# Altium project FMC_SDR.PrjPCB (part 1 of 2)
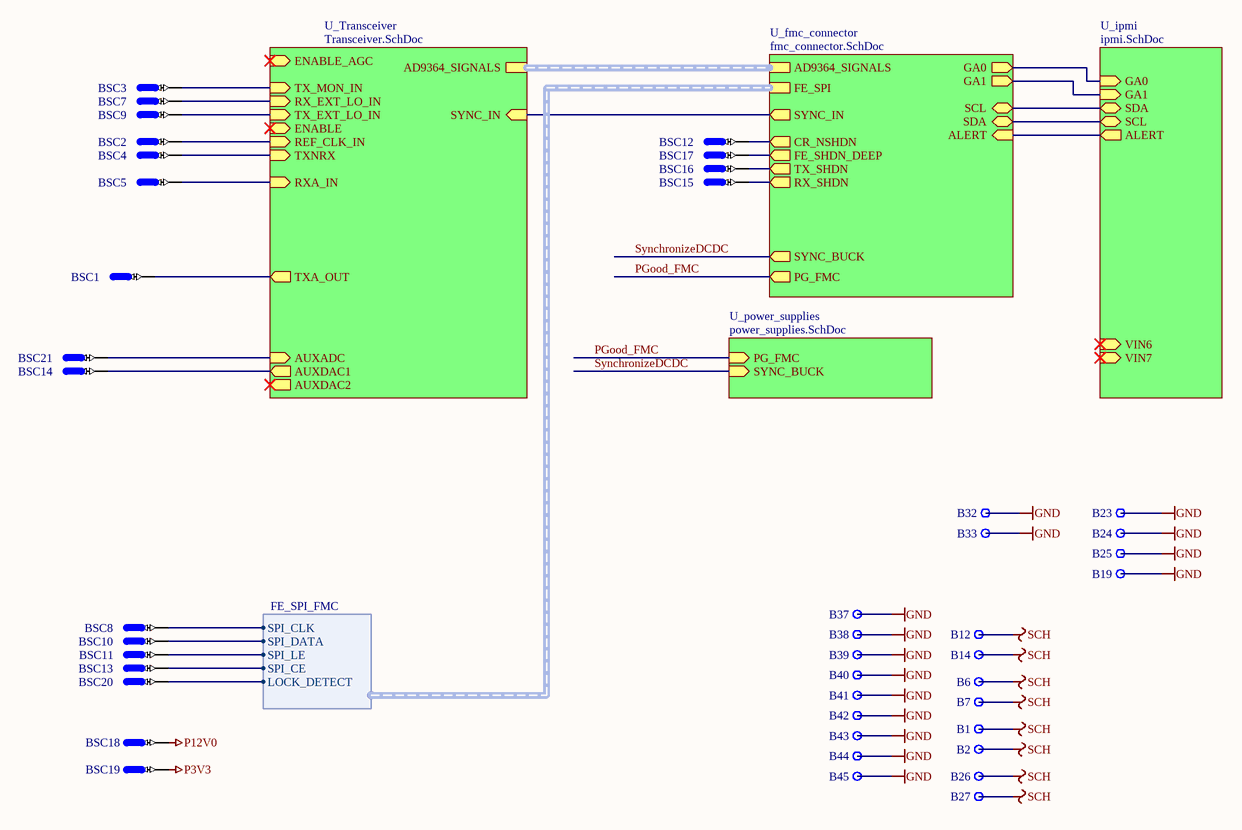
[diagram p0: FMC_SDR_top.SchDoc]
5 sheets, 191 parts. Net scope: flat (ports and power ports of the same name join across sheets).
Board file: FMC_SDR.PcbDoc
Sheets:
  FMC_SDR_top.SchDoc
    U_ipmi = ipmi.SchDoc
    U_power_supplies = power_supplies.SchDoc
    U_Transceiver = Transceiver.SchDoc
    U_fmc_connector = fmc_connector.SchDoc

## Sheet FMC_SDR_top.SchDoc: FMC front panel
size 297 x 209 mm; Date: .DATE; CheckedBy: vanderby; CompanyName: CERN; DrawnBy: mcattin; Engineer: mcattin; Organization: CERN; Address1: European Organization for Nuclear Research; Address2: CH-1211 Genève 23 - Switzerland; DocumentNumber: 3; Revision: -; SheetNumber: 3; SheetTotal: 5; EDA_Number: EDA-02064-V1-0; Projet: FmcDIO16chTTLa; ModifiedBy: mcattin; CreateDate: 11/04/2009; CheckedDate: 11/26/2009; Title2: External connections; DivGrp: BE-CO-HT; Designer: mcattin; ModifiedDate: -

### Parts
B1  Plated Hole  [MTG240_400]  (value not drawn)  (no BOM)
B2  Plated Hole  [MTG240_400]  (value not drawn)  (no BOM)
B6  Plated Hole  [MTG240_400]  (value not drawn)  (no BOM)
B7  Plated Hole  [MTG240_400]  (value not drawn)  (no BOM)
B12  Plated Hole  [MTG240_400]  (value not drawn)  (no BOM)
B14  Plated Hole  [MTG240_400]  (value not drawn)  (no BOM)
B19  Plated Hole  [MTG270_500]  (value not drawn)
B23  Plated Hole  [MTG270_500]  (value not drawn)
B24  Plated Hole  [MTG270_500]  (value not drawn)
B25  Plated Hole  [MTG270_500]  (value not drawn)
B26  Plated Hole  [MTG240_400]  (value not drawn)  (no BOM)
B27  Plated Hole  [MTG240_400]  (value not drawn)  (no BOM)
B32  Plated Hole  [MTG240_400]  (value not drawn)  (no BOM)
B33  Plated Hole  [MTG240_400]  (value not drawn)  (no BOM)
B37  Plated Hole  [MTG240_400]  (value not drawn)  (no BOM)
B38  Plated Hole  [MTG240_400]  (value not drawn)  (no BOM)
B39  Plated Hole  [MTG240_400]  (value not drawn)  (no BOM)
B40  Plated Hole  [MTG240_400]  (value not drawn)  (no BOM)
B41  Plated Hole  [MTG240_400]  (value not drawn)  (no BOM)
B42  Plated Hole  [MTG240_400]  (value not drawn)  (no BOM)
B43  Plated Hole  [MTG240_400]  (value not drawn)  (no BOM)
B44  Plated Hole  [MTG240_400]  (value not drawn)  (no BOM)
B45  Plated Hole  [MTG240_400]  (value not drawn)  (no BOM)
BSC1  0603 Female  [PCB_CONN_0603F]  (value not drawn)
BSC2  0603 Female  [PCB_CONN_0603F]  (value not drawn)
BSC3  0603 Female  [PCB_CONN_0603F]  (value not drawn)
BSC4  0603 Female  [PCB_CONN_0603F]  (value not drawn)
BSC5  0603 Female  [PCB_CONN_0603F]  (value not drawn)
BSC7  0603 Female  [PCB_CONN_0603F]  (value not drawn)
BSC8  0603 Female  [PCB_CONN_0603F]  (value not drawn)
BSC9  0603 Female  [PCB_CONN_0603F]  (value not drawn)
BSC10  0603 Female  [PCB_CONN_0603F]  (value not drawn)
BSC11  0603 Female  [PCB_CONN_0603F]  (value not drawn)
BSC12  0603 Female  [PCB_CONN_0603F]  (value not drawn)
BSC13  0603 Female  [PCB_CONN_0603F]  (value not drawn)
BSC14  0603 Female  [PCB_CONN_0603F]  (value not drawn)
BSC15  0603 Female  [PCB_CONN_0603F]  (value not drawn)
BSC16  0603 Female  [PCB_CONN_0603F]  (value not drawn)
BSC17  0603 Female  [PCB_CONN_0603F]  (value not drawn)
BSC18  1206 Female  [PCB_CONN_1206F]  (value not drawn)
BSC19  1206 Female  [PCB_CONN_1206F]  (value not drawn)
BSC20  0603 Female  [PCB_CONN_0603F]  (value not drawn)
BSC21  0603 Female  [PCB_CONN_0603F]  (value not drawn)

### Sub-sheets
U_fmc_connector = fmc_connector.SchDoc: AD9364_SIGNALS (harness ADF5356_SPI), SCL (bidir), SDA (bidir), GA0 (out), GA1 (out), PG_FMC (out), ALERT (in), SYNC_IN (out), SYNC_BUCK (out), RX_SHDN (out), TX_SHDN (out), FE_SPI (harness FE_SPI_FMC), FE_SHDN_DEEP (out), CR_NSHDN (out)
U_ipmi = ipmi.SchDoc: GA0 (in), GA1 (in), SDA (bidir), VIN6 (in), SCL (bidir), ALERT (out), VIN7 (in)
U_power_supplies = power_supplies.SchDoc: PG_FMC (in), SYNC_BUCK (in)
U_Transceiver = Transceiver.SchDoc: TX_MON_IN (in), RX_EXT_LO_IN (in), SYNC_IN (in), ENABLE_AGC (in), AD9364_SIGNALS (harness AD9364_SIG), TX_EXT_LO_IN (in), ENABLE (in), TXNRX (in), REF_CLK_IN (in), RXA_IN (in), TXA_OUT (out), AUXDAC2 (out), AUXADC (in), AUXDAC1 (out)

### Harnesses
FE_SPI_FMC: SPI_CLK, SPI_DATA, SPI_LE, SPI_CE, LOCK_DETECT

### Nets
GND: B19.1 B23.1 B24.1 B25.1 B32.1 B33.1 B37.1 B38.1 B39.1 B40.1 B41.1 B42.1 B43.1 B44.1 B45.1
P3V3: BSC19.1
P12V0: BSC18.1
SCH: B1.1 B2.1 B6.1 B7.1 B12.1 B14.1 B26.1 B27.1
PGood_FMC: sheet U_power_supplies/PG_FMC, sheet U_fmc_connector/PG_FMC
SynchronizeDCDC: sheet U_power_supplies/SYNC_BUCK, sheet U_fmc_connector/SYNC_BUCK
NetBSC1_1: BSC1.1 ; sheet U_Transceiver/TXA_OUT
NetBSC2_1: BSC2.1 ; sheet U_Transceiver/REF_CLK_IN
NetBSC3_1: BSC3.1 ; sheet U_Transceiver/TX_MON_IN
NetBSC4_1: BSC4.1 ; sheet U_Transceiver/TXNRX
NetBSC5_1: BSC5.1 ; sheet U_Transceiver/RXA_IN
NetBSC7_1: BSC7.1 ; sheet U_Transceiver/RX_EXT_LO_IN
NetBSC8_1: BSC8.1 ; sheet U_fmc_connector/FE_SPI.SPI_CLK
NetBSC9_1: BSC9.1 ; sheet U_Transceiver/TX_EXT_LO_IN
NetBSC10_1: BSC10.1 ; sheet U_fmc_connector/FE_SPI.SPI_DATA
NetBSC11_1: BSC11.1 ; sheet U_fmc_connector/FE_SPI.SPI_LE
NetBSC12_1: BSC12.1 ; sheet U_fmc_connector/CR_NSHDN
NetBSC13_1: BSC13.1 ; sheet U_fmc_connector/FE_SPI.SPI_CE
NetBSC14_1: BSC14.1 ; sheet U_Transceiver/AUXDAC1
NetBSC15_1: BSC15.1 ; sheet U_fmc_connector/RX_SHDN
NetBSC16_1: BSC16.1 ; sheet U_fmc_connector/TX_SHDN
NetBSC17_1: BSC17.1 ; sheet U_fmc_connector/FE_SHDN_DEEP
NetBSC20_1: BSC20.1 ; sheet U_fmc_connector/FE_SPI.LOCK_DETECT
NetBSC21_1: BSC21.1 ; sheet U_Transceiver/AUXADC
(unnamed): sheet U_ipmi/GA0, sheet U_fmc_connector/GA0
(unnamed): sheet U_ipmi/GA1, sheet U_fmc_connector/GA1
(unnamed): sheet U_ipmi/SDA, sheet U_fmc_connector/SCL
(unnamed): sheet U_ipmi/SCL, sheet U_fmc_connector/SDA
(unnamed): sheet U_ipmi/ALERT, sheet U_fmc_connector/ALERT
(unnamed): sheet U_Transceiver/SYNC_IN, sheet U_fmc_connector/SYNC_IN

### Buses and harness runs
harness sheet U_fmc_connector/AD9364_SIGNALS = sheet U_Transceiver/AD9364_SIGNALS

### Notes on the sheet
- Project/Equipment
- Document
- Designer
- Drawn by
- Check.by
- File
- Last Mod.
- Print Date
- Sheet
- Size
- A4
- of
- Rev

### Library data of the parts
B1 B2 B6 B7 B12 B14 B26 B27 B32 B33 B37-B45 = PLATED_HOLE2.4_PAD4.0: Single Terminal Socket; Part Description: Plated Through Hole: Hole Dia.=2.4mm Pad Dia.=4.0mm; Mounted: No; Table: Pads; Part Number: PLATED_HOLE2.4_PAD4.0; Component Type: Standard (No BOM); Pin Count: 1; Family: Plated Hole; Socket: No; SMD: No; Status: None; ComponentHeight: 0mm; Author: CERN DEM JMW; CreateDate: 2011-10-10; LatestRevisionDate: 2011-10-10; PackageDescription: Plated Through Hole: Hole Dia.=2.4mm Pad Dia.=4.0mm
B19 B23-B25 = PLATED_HOLE2.7_PAD5.0: Single Terminal Socket; Part Description: Plated Through Hole: Hole Dia.=2.7mm Pad Dia.=5.0mm; Mounted: No; Part Number: PLATED_HOLE2.7_PAD5.0; Component Kind: Standard (No BOM); Component Type: Standard (No BOM); Pin Count: 1; Family: Plated Hole; Socket: No; SMD: No; Sense: No; Status: None; ComponentHeight: 0mm; HelpURL: Undefined; Author: CERN DEM JMW; CreateDate: 27/09/2011; LatestRevisionDate: 27/09/2011; PackageDescription: Plated Through Hole: Hole Dia.=2.7mm Pad Dia.=5.0mm
BSC1-BSC5 BSC7-BSC17 BSC20 BSC21 = 0603_female_BoardSolderConnector: Part Description: Board connection - soldered 0603 jumper; PressFit: No; Pin Count: 1; Socket: No; SMD: Yes; Sense: No; Status: None; System: Connector
BSC18 BSC19 = 1206_female_BoardSolderConnector: Part Description: Board connection - soldered 1206 jumper; PressFit: No; Pin Count: 1; Socket: No; SMD: Yes; Sense: No; Status: None; System: Connector

## Sheet ipmi.SchDoc: FMC IPMI
size 297 x 209 mm; CheckedBy: vanderby; CompanyName: CERN; DrawnBy: mcattin; Engineer: mcattin; Organization: CERN; Address1: European Organization for Nuclear Research; Address2: CH-1211 Genève 23 - Switzerland; DocumentNumber: 2; Revision: -; SheetNumber: 2; SheetTotal: 5; EDA_Number: EDA-02064-V1-0; Projet: FmcDIO16chTTLa; ModifiedBy: mcattin; CreateDate: 11/04/2009; CheckedDate: 11/26/2009; Title2: EEPROM, temperature sensor; DivGrp: BE-CO-HT; Designer: mcattin; CurrentDate: .DATE; ModifiedDate: -
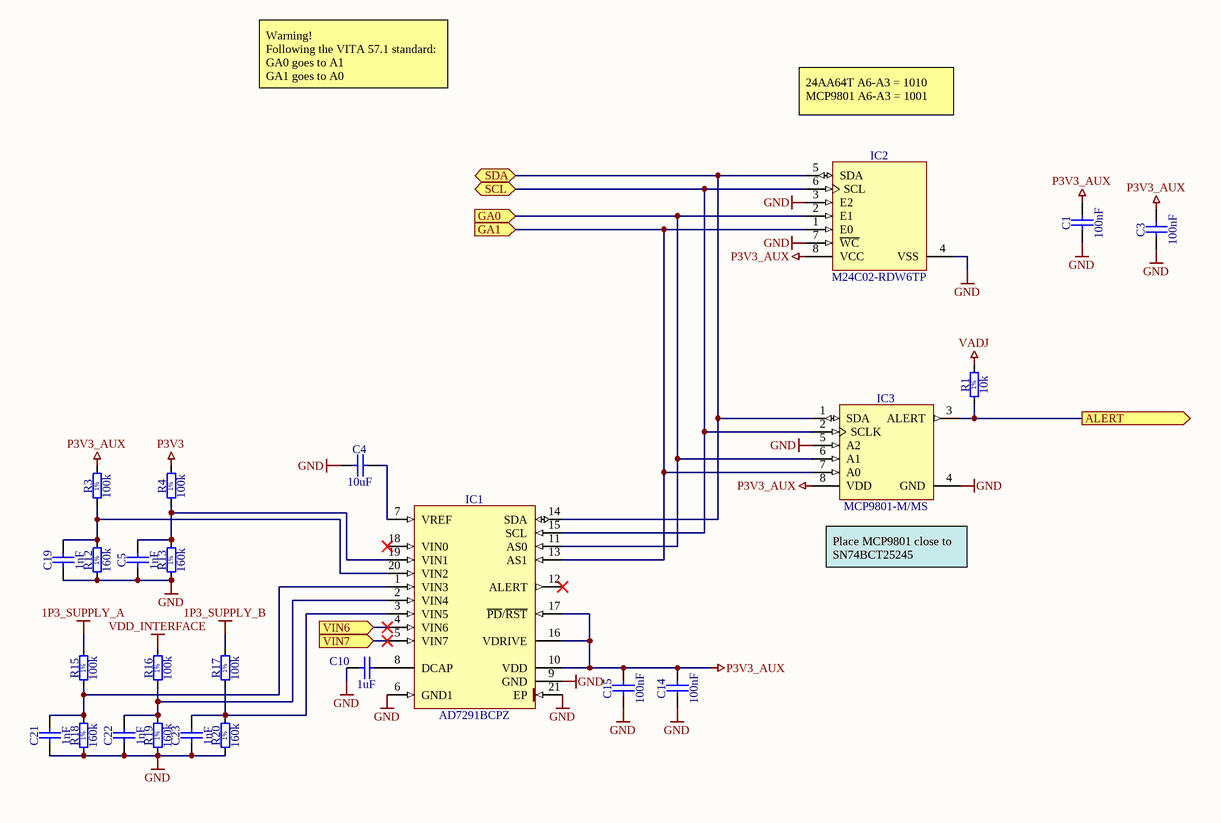
[diagram p1: ipmi.SchDoc]

### Parts
C1  100nF  [CAPC1005X55N]
C3  100nF  [CAPC1005X55N]
C4  10uF  [CAPC1608X87N]
C5  1nF  [CAPC1005X55N]
C10  1uF  [CAPC1608X87N]
C14  100nF  [CAPC1005X55N]
C15  100nF  [CAPC1005X55N]
C19  1nF  [CAPC1005X55N]
C21  1nF  [CAPC1005X55N]
C22  1nF  [CAPC1005X55N]
C23  1nF  [CAPC1005X55N]
IC1  AD7291BCPZ  [QFN50P400X400X80-21N-S275]
IC2  M24C02-RDW6TP  [SOP65P640X120-8N]
IC3  MCP9801-M/MS  [SOP65P490X110-8N]
R1  10k  [RESC1005X40N]
R3  100k  [RESC1005X40N]
R4  100k  [RESC1005X40N]
R12  160k  [RESC1005X40N]
R13  160k  [RESC1005X40N]
R15  100k  [RESC1005X40N]
R16  100k  [RESC1005X40N]
R17  100k  [RESC1005X40N]
R18  160k  [RESC1005X40N]
R19  160k  [RESC1005X40N]
R20  160k  [RESC1005X40N]

### Ports
ALERT (out), GA0 (in), GA1 (in), SCL (bidir), SDA (bidir), VIN6 (in), VIN7 (in)

### Nets
1P3_SUPPLY_A: R15.2
1P3_SUPPLY_B: R17.2
GND: C1.1 C3.1 C4.1 C5.1 C10.1 C14.1 C15.1 C19.1 C21.1 C22.1 C23.1 IC1.6(GND1) IC1.9(GND) IC1.21(EP) IC2.3(E2) IC2.4(VSS) IC2.7(~{WC}) IC3.4(GND) IC3.5(A2) R12.1 R13.1 R18.1 R19.1 R20.1
P3V3: R4.2
P3V3_AUX: C1.2 C3.2 C14.2 C15.2 IC1.10(VDD) IC1.16(VDRIVE) IC1.17(~{PD}/~{RST}) IC2.8(VCC) IC3.8(VDD) R3.2
VADJ: R1.2
VDD_INTERFACE: R16.2
NetC4_2: C4.2 IC1.7(VREF)
NetC5_2: C5.2 IC1.19(VIN1) R4.1 R13.2
NetC10_2: C10.2 IC1.8(DCAP)
NetC19_2: C19.2 IC1.20(VIN2) R3.1 R12.2
NetC21_2: C21.2 IC1.1(VIN3) R15.1 R18.2
NetC22_2: C22.2 IC1.2(VIN4) R16.1 R19.2
NetC23_2: C23.2 IC1.3(VIN5) R17.1 R20.2
NetIC1_4: IC1.4(VIN6) ; port VIN6
NetIC1_5: IC1.5(VIN7) ; port VIN7
NetIC1_11: IC1.11(AS0) IC2.2(E1) IC3.6(A1) ; port GA0
NetIC1_13: IC1.13(AS1) IC2.1(E0) IC3.7(A0) ; port GA1
NetIC1_14: IC1.14(SDA) IC2.5(SDA) IC3.1(SDA) ; port SDA
NetIC1_15: IC1.15(SCL) IC2.6(SCL) IC3.2(SCLK) ; port SCL
NetIC3_3: IC3.3(ALERT) R1.1 ; port ALERT

Not connected (* = marked no-connect by the designer): IC1 12(ALERT)* 18(VIN0)*

### Notes on the sheet
- Warning!
  Following the VITA 57.1 standard:
  GA0 goes to A1
  GA1 goes to A0
- 24AA64T A6-A3 = 1010
  MCP9801 A6-A3 = 1001
- (near IC3) Place MCP9801 close to SN74BCT25245
- Project/Equipment
- Document
- Designer
- Drawn by
- Check.by
- File
- Last Mod.
- Print Date
- Sheet
- Size
- A4
- of
- Rev
- (in symbol R0402_10K_1%_0.0625W_100PPM) 1%
- (in symbol R0402_100K_1%_0.0625W_100PPM) 1%
- (in symbol R0402_160K_1%_0.0625W_100PPM) 1%

### Library data of the parts
C1 C3 C14 C15 = CC0402_100NF_16V_10%_X7R: Non-polarised capacitor; Part Description: SMD Multilayer Chip Ceramic Capacitor; Manufacturer: GENERIC; Manufacturer1 Part Number: GRM155R71C104KA88D; Voltage: 16V; TC: X7R; Tolerance: ±10%; Part Number: CC0402_100NF_16V_10%_X7R; Component Kind: Standard; Component Type: Standard; Pin Count: 2; Value: 100nF; Status: Not Recommended; Manufacturer Part Number: CC0402_100NF_16V_10%_X7R; Case: 0402; Mounted: Yes; Socket: No; SMD: Yes; Sense: No; Manufacturer1 Example: MURATA; Manufacturer1 ComponentHeight: 0.55mm; HelpURL: \\cern.ch\dfs\Applications\Altium\Datasheets\CC0402_X7R_MURATA_GRM.pdf; Author: CERN DEM JLC; CreateDate: 05.12.2013; LatestRevisionDate: 03.12.2007
C4 = CC0603_10UF_6.3V_20%_X5R: Non-polarised capacitor; Part Description: SMD Multilayer Chip Ceramic Capacitor; Manufacturer: GENERIC; Manufacturer1 Part Number: C0603C106M9PAC; Voltage: 6.3V; TC: X5R; Tolerance: ±20%; Part Number: CC0603_10UF_6.3V_20%_X5R; Component Kind: Standard; Component Type: Standard; Pin Count: 2; Value: 10uF; Status: Preferred; Manufacturer Part Number: CC0603_10uF_6.3V_20%_X5R; Case: 0603; Mounted: Yes; Socket: No; SMD: Yes; Sense: No; Manufacturer1 Example: KEMET; Manufacturer1 ComponentHeight: 0.95mm; HelpURL: \\cern.ch\dfs\Applications\Altium\Datasheets\CC0603_X5R_KEMET.pdf; Author: CERN DEM JLC; CreateDate: 03.12.2007; LatestRevisionDate: 03.12.2007
C5 C19 C21-C23 = CC0402_1NF_50V_10%_X7R: Non-polarised capacitor; Part Description: SMD Multilayer Chip Ceramic Capacitor; Manufacturer: GENERIC; Manufacturer1 Part Number: 223858715623; Voltage: 50V; TC: X7R; Tolerance: ±10%; Part Number: CC0402_1NF_50V_10%_X7R; Component Kind: Standard; Component Type: Standard; Pin Count: 2; Value: 1nF; Status: Not Recommended; Manufacturer Part Number: CC0402_1NF_50V_10%_X7R; Case: 0402; Mounted: Yes; Socket: No; SMD: Yes; Sense: No; Manufacturer1 Example: PHYCOMP; Manufacturer1 ComponentHeight: 0.55mm; HelpURL: \\cern.ch\dfs\Applications\Altium\Datasheets\CC0402_X7R_PHYCOMP.pdf; Author: CERN DEM JLC; CreateDate: 03.12.2007; LatestRevisionDate: 03.12.2007
C10 = CC0603_1UF_16V_10%_X7R: Non-polarised capacitor; Part Description: SMD Multilayer Chip Ceramic Capacitor; Manufacturer: GENERIC; Manufacturer1 Part Number: 223878615663; Voltage: 16V; TC: X7R; Tolerance: ±10%; Part Number: CC0603_1UF_16V_10%_X7R; Component Kind: Standard; Component Type: Standard; Pin Count: 2; Value: 1uF; Status: None; Manufacturer Part Number: CC0603_1uF_16V_10%_X7R; Case: 0603; Mounted: Yes; Socket: No; SMD: Yes; Sense: No; Manufacturer1 Example: YAGEO PHYCOMP; Manufacturer1 ComponentHeight: 0.9mm; HelpURL: \\cern.ch\dfs\Applications\Altium\Datasheets\CC0603_X7R_PHYCOMP.pdf; Author: CERN DEM JLC; CreateDate: 03.12.2007; LatestRevisionDate: 17.04.2015
IC1 = AD7291BCPZ: 8-Channel, I2C, 12-Bit SAR ADC with Temperature Sensor; Manufacturer: ANALOG DEVICES; PressFit: No; Bonding: No; Part Number: AD7291BCPZ; Component Kind: Standard; Component Type: Standard; Device: AD7291BCPZ; PackageDescription: QFN, 0.50mm Pitch, Square; 20 Pin, 4.00mm L X 4.00mm W X 0.80mm H Body (w/Thermal Tab 2.75 X 2.75mm),  IPC Medium Density; Part Description: 8-Channel, I2C, 12-Bit SAR ADC with Temperature Sensor; Manufacturer Part Number: AD7291BCPZ; Pin Count: 21; Case: QFN20; Mounted: Yes; Socket: No; SMD: Yes; Sense: No; ComponentHeight: 0.8mm; Author: CERN DEM JLC; HelpURL: \\cern.ch\dfs\Applications\Altium\Datasheets\AD7291BCPZ.pdf; CreateDate: 29.08.2017; LatestRevisionDate: 29.08.2017
IC2 = M24C02-RDW6TP: 2-Kbit (256 x 8bit) Serial I2C Bus EEPROM; Manufacturer: ST MICROELECTRONICS; PressFit: No; Bonding: No; Part Number: M24C02-RDW6TP; Component Kind: Standard; Component Type: Standard; Device: M24C02-RDW6TP; PackageDescription: SOP, 0.65mm pitch; 8 pin, 4.40mm W X 3.00mm L X 1.20mm H body, IPC Medium Density; Part Description: 2-Kbit (256 x 8bit) Serial I2C Bus EEPROM; Manufacturer Part Number: M24C02-RDW6TP; Pin Count: 8; Case: TSSOP8; Mounted: Yes; Socket: No; SMD: Yes; Sense: No; ComponentHeight: 1.2mm; HelpURL: \\cern.ch\dfs\Applications\Altium\Datasheets\M24C02-RDW6TP.pdf; Author: CERN DEM JLC; CreateDate: 30.08.2017; LatestRevisionDate: 30.08.2017
IC3 = MCP9801-M/MS: 2-Wire High-Accuracy Temperature Sensor; Manufacturer: MICROCHIP TECHNOLOGIY; Table: Sensors; Part Number: MCP9801-M/MS; Component Kind: Standard; Component Type: Standard; Designator: MCP9801-M/MS; Device: MCP9801-M/MS; PackageDescription: SOP, 0.65mm pitch; 8 pin, 3.00mm W X 3.00mm L X 1.10mm H body, IPC Medium Density; Part Description: 2-Wire High-Accuracy Temperature Sensor; Manufacturer Part Number: MCP9801-M/MS; Pin Count: 8; Case: MSOP8; Mounted: Yes; Socket: No; SMD: Yes; ComponentHeight: 1.1mm; Datasheet: \\cern.ch\dfs\Applications\Altium\Datasheets\MCP9801-M-MS.pdf; HelpURL: \\cern.ch\dfs\Applications\Altium\Datasheets\MCP9801-M-MS.pdf; Author: CERN DEM JLC; CreateDate: 11/18/2009; LatestRevisionDate: 11/18/2009
R1 = R0402_10K_1%_0.0625W_100PPM: Resistor - 1%; Part Description: General Purpose Thick Film Chip Resistor; Manufacturer: GENERIC; Manufacturer1 Part Number: 232270671003L; TC: ±100ppm/°C; PressFit: No; Part Number: R0402_10K_1%_0.0625W_100PPM; Component Kind: Standard; Component Type: Standard; Pin Count: 2; Value: 10k; Status: Not Recommended; Power: 0.0625W; Tolerance: ±1%; Manufacturer Part Number: R0402_10K_1%_0.0625W_100PPM; Case: 0402; Mounted: Yes; Sense: No; Socket: No; SMD: Yes; Manufacturer1 Example: YAGEO PHYCOMP; Manufacturer1 ComponentHeight: 0.4mm; HelpURL: \\cern.ch\dfs\Applications\Altium\Datasheets\R0402_Phycomp_RC0402.pdf; Author: CERN DEM JLC; CreateDate: 03.12.2007; LatestRevisionDate: 17.10.2012
R3 R4 R15-R17 = R0402_100K_1%_0.0625W_100PPM: Resistor - 1%; Part Description: General Purpose Thick Film Chip Resistor; Manufacturer: GENERIC; Manufacturer1 Part Number: 232270671004L; TC: ±100ppm/°C; PressFit: No; Part Number: R0402_100K_1%_0.0625W_100PPM; Component Kind: Standard; Component Type: Standard; Pin Count: 2; Value: 100k; Status: Not Recommended; Power: 0.0625W; Tolerance: ±1%; Manufacturer Part Number: R0402_100K_1%_0.0625W_100PPM; Case: 0402; Mounted: Yes; Sense: No; Socket: No; SMD: Yes; Manufacturer1 Example: YAGEO PHYCOMP; Manufacturer1 ComponentHeight: 0.4mm; HelpURL: \\cern.ch\dfs\Applications\Altium\Datasheets\R0402_Phycomp_RC0402.pdf; Author: CERN DEM JLC; CreateDate: 03.12.2007; LatestRevisionDate: 17.10.2012
R12 R13 R18-R20 = R0402_160K_1%_0.0625W_100PPM: Resistor - 1%; Part Description: General Purpose Thick Film Chip Resistor; Manufacturer: GENERIC; Manufacturer1 Part Number: 232270671604L; TC: ±100ppm/°C; PressFit: No; Part Number: R0402_160K_1%_0.0625W_100PPM; Component Kind: Standard; Component Type: Standard; Pin Count: 2; Value: 160k; Status: Not Recommended; Power: 0.0625W; Tolerance: ±1%; Manufacturer Part Number: R0402_160K_1%_0.0625W_100PPM; Case: 0402; Mounted: Yes; Sense: No; Socket: No; SMD: Yes; Manufacturer1 Example: YAGEO PHYCOMP; Manufacturer1 ComponentHeight: 0.4mm; HelpURL: \\cern.ch\dfs\Applications\Altium\Datasheets\R0402_Phycomp_RC0402.pdf; Author: CERN DEM JLC; CreateDate: 03.12.2007; LatestRevisionDate: 17.10.2012

## Sheet power_supplies.SchDoc: Title
size 420 x 297 mm; CheckedBy: -; CompanyName: CERN; DrawnBy: DrawnBy; Organization: CERN; Address1: European Organization for Nuclear Research; Address2: CH-1211 Genčve 23 - Switzerland; Revision: -; SheetNumber: -; SheetTotal: -; EDA_Number: EDA-XXXXX-VX-X; Projet: -; ModifiedBy: -; CreateDate: XX/XX/XXXX; CheckedDate: -; Title2: Title2; DivGrp: TE/MPE; Designer: Designer; ModifiedDate: -
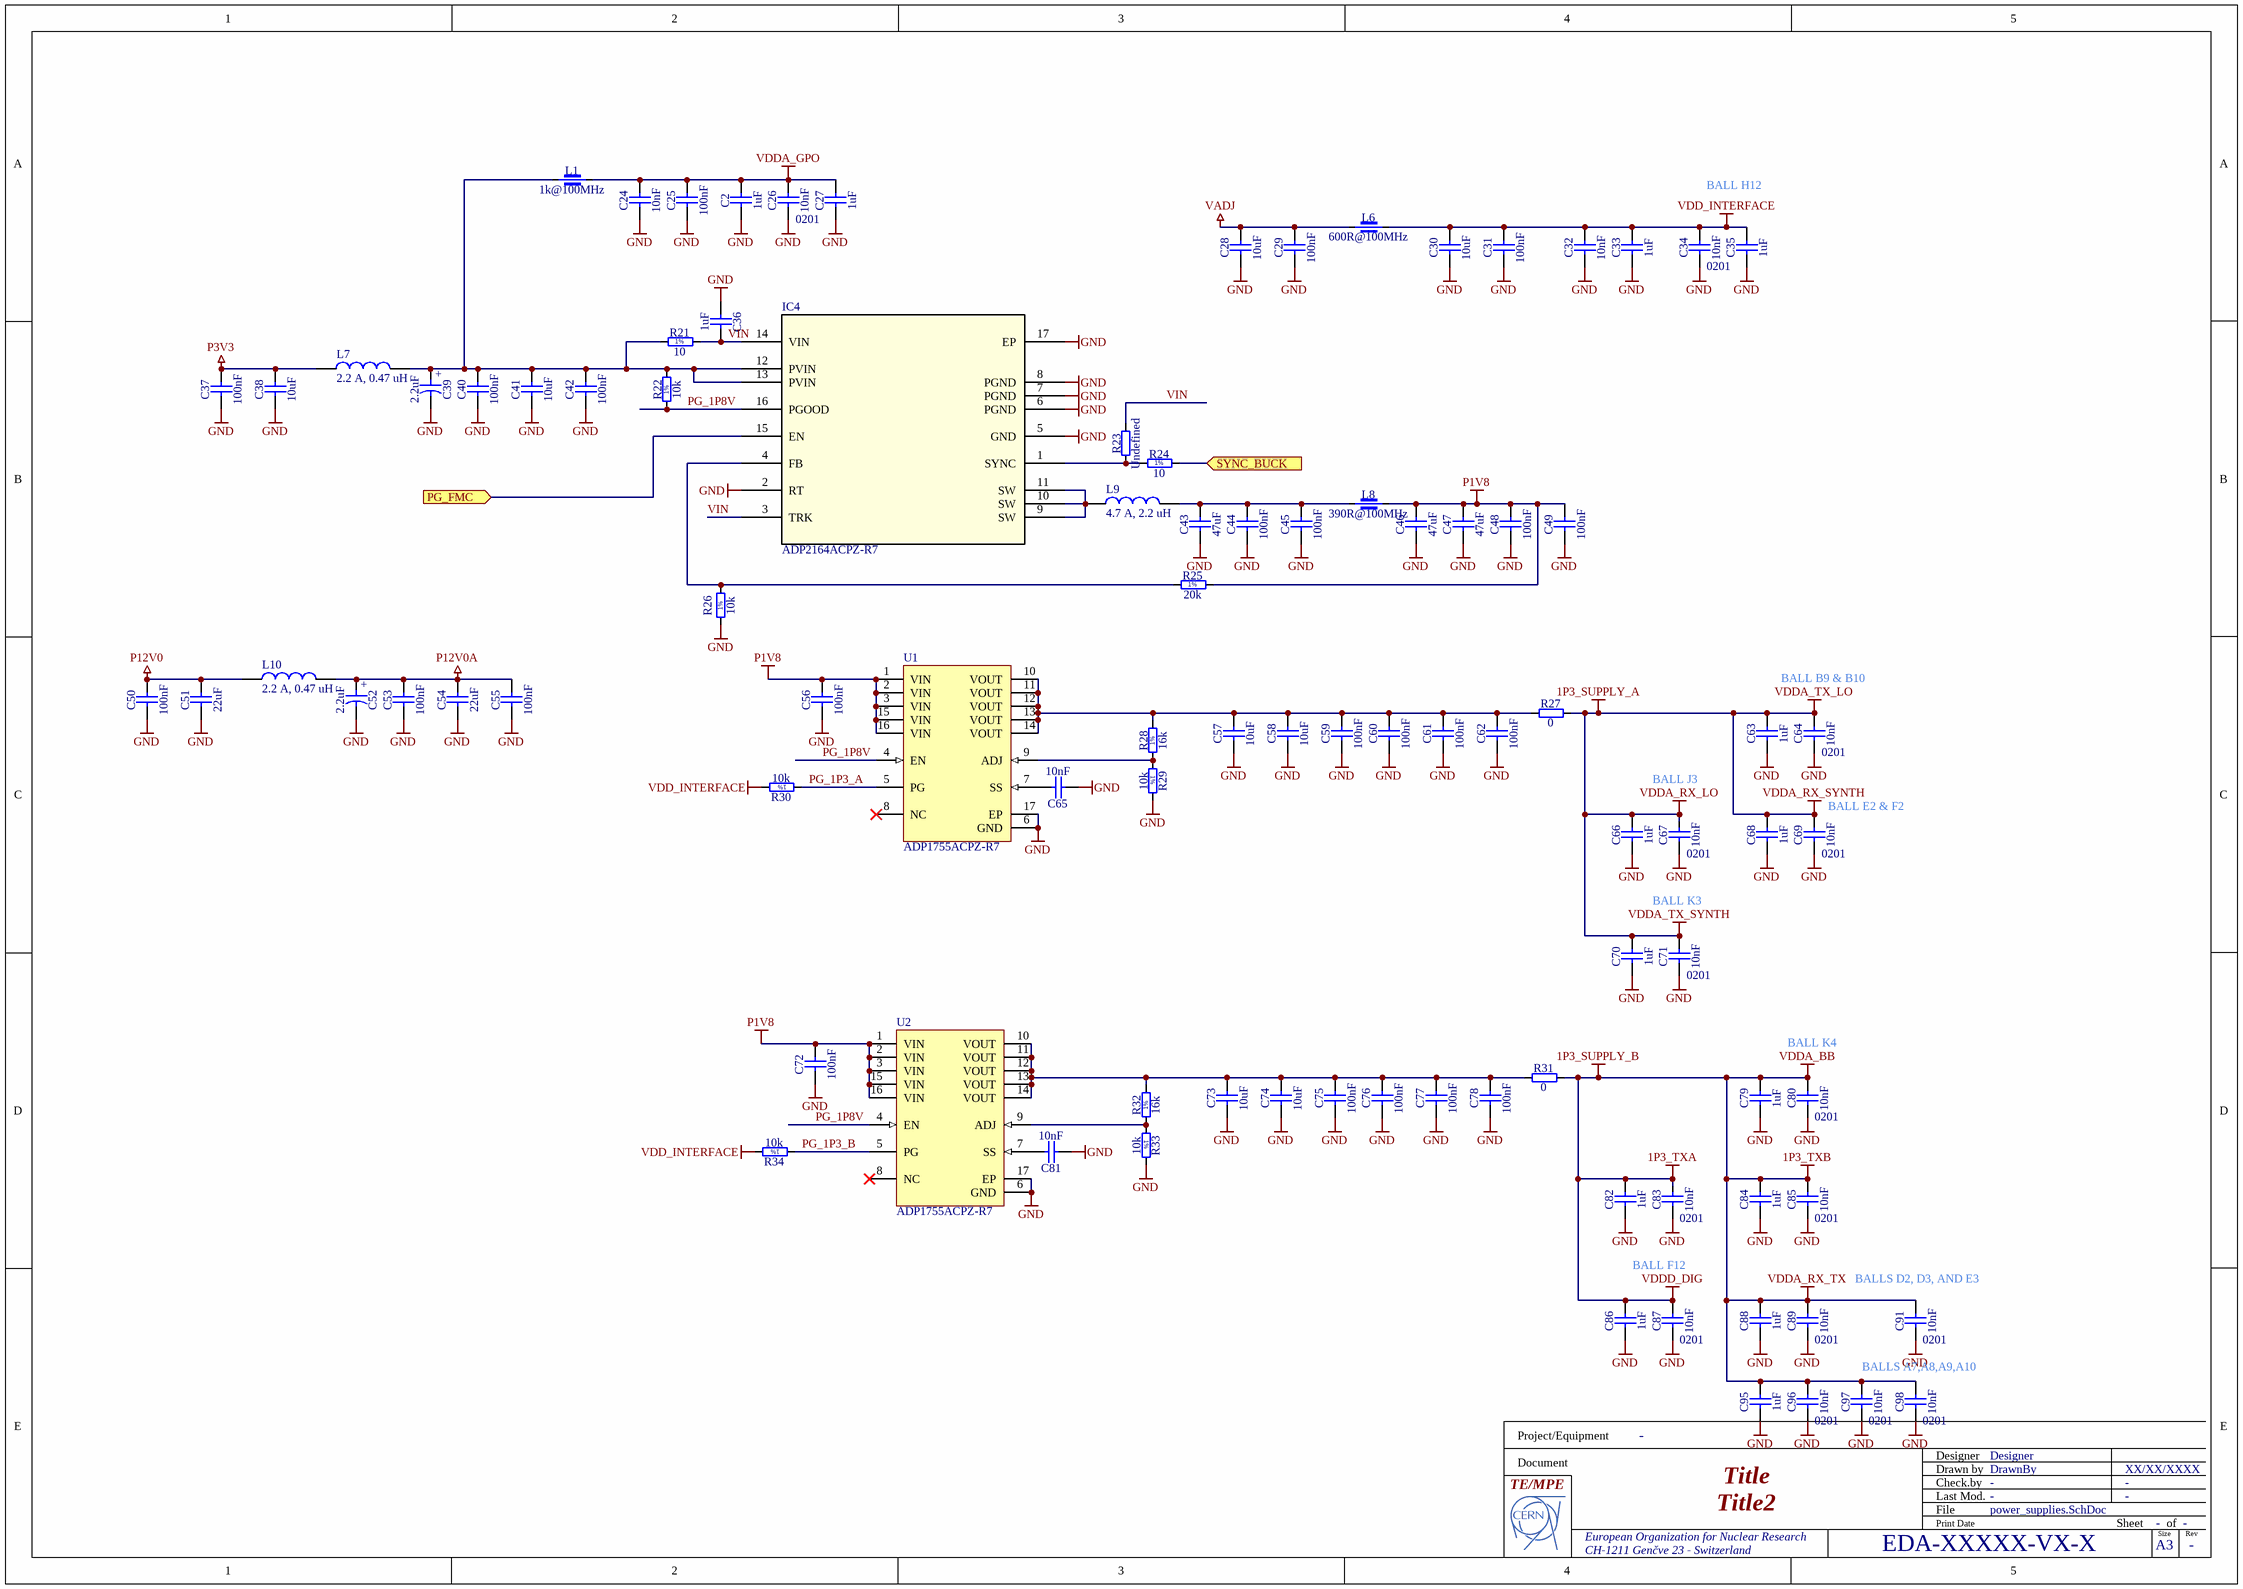
[diagram p2: power_supplies.SchDoc]

### Parts
C2  1uF  [CAPC1005X55N]
C24  10nF  [CAPC1005X55N]
C25  100nF  [CAPC1005X55N]
C26  10nF  Case: 0201  [CAPC0603X33N]
C27  1uF  [CAPC1005X55N]
C28  10uF  [CAPC1608X87N]
C29  100nF  [CAPC1005X55N]
C30  10uF  [CAPC1608X87N]
C31  100nF  [CAPC1005X55N]
C32  10nF  [CAPC1005X55N]
C33  1uF  [CAPC1005X55N]
C34  10nF  Case: 0201  [CAPC0603X33N]
C35  1uF  [CAPC1005X55N]
C36  1uF  [CAPC1005X55N]
C37  100nF  [CAPC1005X55N]
C38  10uF  [CAPC1608X87N]
C39  2.2uF  [CAPMP3216X180N]
C40  100nF  [CAPC1005X55N]
C41  10uF  [CAPC1608X87N]
C42  100nF  [CAPC1005X55N]
C43  47uF  [CAPC3216X180N]
C44  100nF  [CAPC1005X55N]
C45  100nF  [CAPC1005X55N]
C46  47uF  [CAPC3216X180N]
C47  47uF  [CAPC3216X180N]
C48  100nF  [CAPC1005X55N]
C49  100nF  [CAPC1005X55N]
C50  100nF  [CAPC1005X55N]
C51  22uF  [CAPC3216X180N]
C52  2.2uF  [CAPMP3216X180N]
C53  100nF  [CAPC1005X55N]
C54  22uF  [CAPC3216X180N]
C55  100nF  [CAPC1005X55N]
C56  100nF  [CAPC1005X55N]
C57  10uF  [CAPC1608X87N]
C58  10uF  [CAPC1608X87N]
C59  100nF  [CAPC1005X55N]
C60  100nF  [CAPC1005X55N]
C61  100nF  [CAPC1005X55N]
C62  100nF  [CAPC1005X55N]
C63  1uF  [CAPC1005X55N]
C64  10nF  Case: 0201  [CAPC0603X33N]
C65  10nF  [CAPC1005X55N]
C66  1uF  [CAPC1005X55N]
C67  10nF  Case: 0201  [CAPC0603X33N]
C68  1uF  [CAPC1005X55N]
C69  10nF  Case: 0201  [CAPC0603X33N]
C70  1uF  [CAPC1005X55N]
C71  10nF  Case: 0201  [CAPC0603X33N]
C72  100nF  [CAPC1005X55N]
C73  10uF  [CAPC1608X87N]
C74  10uF  [CAPC1608X87N]
C75  100nF  [CAPC1005X55N]
C76  100nF  [CAPC1005X55N]
C77  100nF  [CAPC1005X55N]
C78  100nF  [CAPC1005X55N]
C79  1uF  [CAPC1005X55N]
C80  10nF  Case: 0201  [CAPC0603X33N]
C81  10nF  [CAPC1005X55N]
C82  1uF  [CAPC1005X55N]
C83  10nF  Case: 0201  [CAPC0603X33N]
C84  1uF  [CAPC1005X55N]
C85  10nF  Case: 0201  [CAPC0603X33N]
C86  1uF  [CAPC1005X55N]
C87  10nF  Case: 0201  [CAPC0603X33N]
C88  1uF  [CAPC1005X55N]
C89  10nF  Case: 0201  [CAPC0603X33N]
C91  10nF  Case: 0201  [CAPC0603X33N]
C95  1uF  [CAPC1005X55N]
C96  10nF  Case: 0201  [CAPC0603X33N]
C97  10nF  Case: 0201  [CAPC0603X33N]
C98  10nF  Case: 0201  [CAPC0603X33N]
IC4  ADP2164ACPZ-R7  [CP_16_26]
L1  1k@100MHz  [INDC1005X55N]
L6  600R@100MHz  [INDC1608X75N]
L7  2.2 A, 0.47 uH  [WE-MAIA_2506]
L8  390R@100MHz  [INDC1608X95N]
L9  4.7 A, 2.2 uH  [WE-MAIA_4020]
L10  2.2 A, 0.47 uH  [WE-MAIA_2506]
R21  10  [RESC1608X55N]
R22  10k  [RESC1005X40N]
R23  Undefined  [RESC1608X55N]
R24  10  [RESC1608X55N]
R25  20k  [RESC1005X40N]
R26  10k  [RESC1005X40N]
R27  0  [RESC1608X55N]
R28  16k  [RESC1005X40N]
R29  10k  [RESC1005X40N]
R30  10k  [RESC1005X40N]
R31  0  [RESC1608X55N]
R32  16k  [RESC1005X40N]
R33  10k  [RESC1005X40N]
R34  10k  [RESC1005X40N]
U1  ADP1755ACPZ-R7  [CP-16-4_L]
U2  ADP1755ACPZ-R7  [CP-16-4_L]

### Ports
PG_FMC (in), SYNC_BUCK (in)

### Nets
1P3_SUPPLY_A: C63.2 C64.2 C66.2 C67.2 C68.2 C69.2 C70.2 C71.2 R27.2  [also labelled VDDA_RX_LO, VDDA_RX_SYNTH, VDDA_TX_LO, VDDA_TX_SYNTH]
1P3_SUPPLY_B: C79.2 C80.2 C82.2 C83.2 C84.2 C85.2 C86.2 C87.2 C88.2 C89.2 C91.2 C95.2 C96.2 C97.2 C98.2 R31.2  [also labelled 1P3_TXA, 1P3_TXB, VDDA_BB, VDDA_RX_TX, VDDD_DIG]
GND: C2.1 C24.1 C25.1 C26.1 C27.1 C28.1 C29.1 C30.1 C31.1 C32.1 C33.1 C34.1 C35.1 C36.1 C37.1 C38.1 C39.2 C40.1 C41.1 C42.1 C43.1 C44.1 C45.1 C46.1 C47.1 C48.1 C49.1 C50.1 C51.1 C52.2 C53.1 C54.1 C55.1 C56.1 C57.1 C58.1 C59.1 C60.1 C61.1 C62.1 C63.1 C64.1 C65.1 C66.1 C67.1 C68.1 C69.1 C70.1 C71.1 C72.1 C73.1 C74.1 C75.1 C76.1 C77.1 C78.1 C79.1 C80.1 C81.1 C82.1 C83.1 C84.1 C85.1 C86.1 C87.1 C88.1 C89.1 C91.1 C95.1 C96.1 C97.1 C98.1 IC4.2(RT) IC4.5(GND) IC4.6(PGND) IC4.7(PGND) IC4.8(PGND) IC4.17(EP) R26.1 R29.2 R33.2 U1.6(GND) U1.17(EP) U2.6(GND) U2.17(EP)
P1V8: C46.2 C47.2 C48.2 C49.2 C56.2 C72.2 L8.2 R25.2 U1.1(VIN) U1.2(VIN) U1.3(VIN) U1.15(VIN) U1.16(VIN) U2.1(VIN) U2.2(VIN) U2.3(VIN) U2.15(VIN) U2.16(VIN)
P3V3: C37.2 C38.2 L7.1
P12V0: C50.2 C51.2 L10.1
P12V0A: C52.1 C53.2 C54.2 C55.2 L10.2
VADJ: C28.2 C29.2 L6.1
VDD_INTERFACE: C30.2 C31.2 C32.2 C33.2 C34.2 C35.2 L6.2 R30.2 R34.2
VDDA_GPO: C2.2 C24.2 C25.2 C26.2 C27.2 L1.2
PG_1P3_A: R30.1 U1.5(PG)
PG_1P3_B: R34.1 U2.5(PG)
PG_1P8V: IC4.16(PGOOD) R22.1 U1.4(EN) U2.4(EN)
VIN: C36.2 IC4.3(TRK) IC4.14(VIN) R21.2 R23.2
NetC39_1: C39.1 C40.2 C41.2 C42.2 IC4.12(PVIN) IC4.13(PVIN) L1.1 L7.2 R21.1 R22.2
NetC43_2: C43.2 C44.2 C45.2 L8.1 L9.2
NetC57_2: C57.2 C58.2 C59.2 C60.2 C61.2 C62.2 R27.1 R28.2 U1.10(VOUT) U1.11(VOUT) U1.12(VOUT) U1.13(VOUT) U1.14(VOUT)
NetC65_2: C65.2 U1.7(SS)
NetC73_2: C73.2 C74.2 C75.2 C76.2 C77.2 C78.2 R31.1 R32.2 U2.10(VOUT) U2.11(VOUT) U2.12(VOUT) U2.13(VOUT) U2.14(VOUT)
NetC81_2: C81.2 U2.7(SS)
NetIC4_1: IC4.1(SYNC) R23.1 R24.1
NetIC4_4: IC4.4(FB) R25.1 R26.2
NetIC4_9: IC4.9(SW) IC4.10(SW) IC4.11(SW) L9.1
NetIC4_15: IC4.15(EN) ; port PG_FMC
NetJ2_d20: R24.2 ; port SYNC_BUCK
NetR28_1: R28.1 R29.1 U1.9(ADJ)
NetR32_1: R32.1 R33.1 U2.9(ADJ)

Not connected (* = marked no-connect by the designer): U1 8(NC)*; U2 8(NC)*

### Notes on the sheet
- BALL H12
- BALL B9 & B10
- BALL J3
- (near C69) BALL E2 & F2
- BALL K3
- BALL K4
- BALL F12
- (near C91) BALLS D2, D3, AND E3
- BALLS A7,A8,A9,A10
- Project/Equipment
- Document
- Designer
- Drawn by
- Check.by
- File
- Last Mod.
- Print Date
- Sheet
- Size
- A3
- of
- Rev
- (in symbol CTE3216-18_2.2UF_25V_10%) +
- (in symbol R0402_10K_1%_0.0625W_100PPM) 1%
- (in symbol R0402_16K_1%_0.0625W_100PPM) 1%
- (in symbol R0402_20K_1%_0.0625W_100PPM) 1%
- (in symbol R0603_10R_1%_0.1W_200PPM) 1%

### Library data of the parts
C2 C27 C33 C35 C36 C63 C66 C68 C70 C79 C82 C84 C86 C88 C95 = CC0402_1UF_16V_10%_X5R: Non-polarised capacitor; Part Description: SMD Multilayer Chip Ceramic Capacitor; Manufacturer: GENERIC; Manufacturer1 Part Number: C1005X5R1C105KT; Voltage: 16V; TC: X5R; Tolerance: ±10%; Part Number: CC0402_1UF_16V_10%_X5R; Component Kind: Standard; Component Type: Standard; Pin Count: 2; Value: 1uF; Status: Preferred; Manufacturer Part Number: CC0402_1UF_16V_10%_X5R; Case: 0402; Mounted: Yes; Socket: No; SMD: Yes; Sense: No; Manufacturer1 Example: TDK; Manufacturer1 ComponentHeight: 0.55mm; HelpURL: \\cern.ch\dfs\Applications\Altium\Datasheets\CC0402_X5R_TDK_C.pdf; Author: CERN DEM JLC; CreateDate: 25.10.2012; LatestRevisionDate: 25.10.2012
C24 C32 C65 C81 = CC0402_10NF_16V_10%_X7R: Non-polarised capacitor; Part Description: SMD Multilayer Chip Ceramic Capacitor; Manufacturer: GENERIC; Manufacturer1 Part Number: 223878715636; Voltage: 16V; TC: X7R; Tolerance: ±10%; Part Number: CC0402_10NF_16V_10%_X7R; Component Kind: Standard; Component Type: Standard; Pin Count: 2; Value: 10nF; Status: Not Recommended; Manufacturer Part Number: CC0402_10NF_16V_10%_X7R; Case: 0402; Mounted: Yes; Socket: No; SMD: Yes; Sense: No; Manufacturer1 Example: PHYCOMP; Manufacturer1 ComponentHeight: 0.55mm; HelpURL: \\cern.ch\dfs\Applications\Altium\Datasheets\CC0402_X7R_PHYCOMP.pdf; Author: CERN DEM JLC; CreateDate: 03.12.2007; LatestRevisionDate: 03.12.2007
C25 C29 C31 C37 C40 C42 C44 C45 C48-C50 C53 C55 C56 C59-C62 C72 C75-C78 = CC0402_100NF_16V_10%_X7R: as C1 on sheet ipmi; Part Number: CC0402_100NF_16V_10%_X7R; Component Kind: Standard; Component Type: Standard; Pin Count: 2; Value: 100nF; Status: Not Recommended; Manufacturer Part Number: CC0402_100NF_16V_10%_X7R; Case: 0402; Mounted: Yes; Socket: No; SMD: Yes; Sense: No; Manufacturer1 Example: MURATA; Manufacturer1 ComponentHeight: 0.55mm; HelpURL: \\cern.ch\dfs\Applications\Altium\Datasheets\CC0402_X7R_MURATA_GRM.pdf; Author: CERN DEM JLC; CreateDate: 05.12.2013; LatestRevisionDate: 03.12.2007
C26 C34 C64 C67 C69 C71 C80 C83 C85 C87 C89 C91 C96-C98 = CC0201_10NF_10V_10%_X5R: Non-polarised capacitor; Part Description: SMD Multilayer Chip Ceramic Capacitor; Manufacturer: GENERIC; Manufacturer1 Part Number: 0201ZD103KAT2A; Voltage: 10V; TC: X5R; Tolerance: ±10%; Part Number: CC0201_10NF_10V_10%_X5R; Component Kind: Standard; Component Type: Standard; Pin Count: 2; Value: 10nF; Status: Not Recommended; Manufacturer Part Number: CC0201_10NF_10V_10%_X5R; Mounted: Yes; Socket: No; SMD: Yes; Sense: No; Manufacturer1 Example: AVX; Manufacturer1 ComponentHeight: 0.33mm; HelpURL: \\cern.ch\dfs\Applications\Altium\Datasheets\CC0201_X5R_AVX.pdf; Author: CERN DEM JLC; CreateDate: 03.12.2007; LatestRevisionDate: 03.12.2007
C28 C30 C38 C41 C57 C58 C73 C74 = CC0603_10UF_6.3V_20%_X5R: as C4 on sheet ipmi; Part Number: CC0603_10UF_6.3V_20%_X5R; Component Kind: Standard; Component Type: Standard; Pin Count: 2; Value: 10uF; Status: Preferred; Manufacturer Part Number: CC0603_10uF_6.3V_20%_X5R; Case: 0603; Mounted: Yes; Socket: No; SMD: Yes; Sense: No; Manufacturer1 Example: KEMET; Manufacturer1 ComponentHeight: 0.95mm; HelpURL: \\cern.ch\dfs\Applications\Altium\Datasheets\CC0603_X5R_KEMET.pdf; Author: CERN DEM JLC; CreateDate: 03.12.2007; LatestRevisionDate: 03.12.2007
C39 C52 = CTE3216-18_2.2UF_25V_10%: Polarised capacitor; Part Description: Solid Tantalum Chip Capacitor; Manufacturer: GENERIC; Manufacturer1 Part Number: TAJA225K025R; Voltage: 25V; Tolerance: ±10%; Part Number: CTE3216-18_2.2UF_25V_10%; Component Kind: Standard; Component Type: Standard; Pin Count: 2; Value: 2.2uF; Status: Preferred; Manufacturer Part Number: CTE3216-18_2.2UF_25V_10%; Case: A; Mounted: Yes; Socket: No; SMD: Yes; Sense: No; Manufacturer1 Example: AVX; Manufacturer1 ComponentHeight: 1.8mm; HelpURL: \\cern.ch\dfs\Applications\Altium\Datasheets\CTE_AVX_TAJ.pdf; Author: CERN DEM JLC; CreateDate: 26.05.2008; LatestRevisionDate: 26.05.2008
C43 C46 C47 = CC1206_47UF_25V_20%_X5R: Non-polarised capacitor; Part Description: SMD Multilayer Chip Ceramic Capacitor; Manufacturer: GENERIC; Manufacturer1 Part Number: C3216X5R1E476M160AC; Voltage: 25V; TC: X5R; Tolerance: ±20%; Part Number: CC1206_47UF_25V_20%_X5R; Component Kind: Standard; Component Type: Standard; Pin Count: 2; Value: 47uF; Status: None; Manufacturer Part Number: CC1206_47UF_25V_20%_X5R; Case: 1206; Mounted: Yes; Socket: No; SMD: Yes; Sense: No; Manufacturer1 Example: TDK; Manufacturer1 ComponentHeight: 1.8mm; HelpURL: \\cern.ch\dfs\Applications\Altium\Datasheets\CC1206_X5R_TDK_C.pdf; Author: CERN DEM JLC; CreateDate: 20.11.2013; LatestRevisionDate: 14.03.2017
C51 C54 = CC1206_22UF_35V_20%_JB_TDK_C3216JB1V226M160AC: Non-polarised capacitor; Part Description: SMD Multilayer Chip Ceramic Capacitor; Manufacturer: TDK; Voltage: 35V; TC: JB(±10%); Tolerance: ±20%; Part Number: CC1206_22UF_35V_20%_JB_TDK_C3216JB1V226M160AC; Component Kind: Standard; Component Type: Standard; Pin Count: 2; Value: 22uF; Status: None; Manufacturer Part Number: C3216JB1V226M160AC; Case: 1206; Mounted: Yes; Socket: No; SMD: Yes; Sense: No; ComponentHeight: 1.8mm; HelpURL: \\cern.ch\dfs\Applications\Altium\Datasheets\CC1206_TDK_C3216JB1V226M160AC.pdf; Author: CERN DEM JLC; CreateDate: 13.07.2017; LatestRevisionDate: 13.07.2017
IC4 = PM_ADP2164ACPZ-R7: 6.5 V, 4 A, High Efficiency,Step-Down,DC-to-DC Regulator; Vendor: Analog Devices Inc; Built_By: EMA_UL_Team; Manufacturer_Part_Number: ADP2164ACPZ-R7; Copyright: Copyright (C) 2018 Accelerated Designs. All rights reserved; RefDes: RefDes; Type: DEV; Value: Value
L1 = IND0402_MURATA_BLM15HD102SN1: Part Description: SMD EMIFIL Suppression Chip Ferrite Bead; Manufacturer: MURATA; Manufacturer Part Number: BLM15HD102SN1D; Power: 250mA; Resistance: 1.25R; Tolerance: ±25%; Part Number: IND0402_MURATA_BLM15HD102SN1; Component Kind: Standard; Component Type: Standard; Pin Count: 2; Value: 1k@100MHz; Status: None; Case: 0402; Mounted: Yes; Socket: No; SMD: Yes; Sense: No; ComponentHeight: 0.55mm; HelpURL: \\cern.ch\dfs\Applications\Altium\Datasheets\IND0402_MURATA_BLM15H.pdf; Author: CERN DEM JLC; CreateDate: 06.03.2012; LatestRevisionDate: 25.10.2018
L6 = IND0603_TDK_MMZ1608B601CTAH0: Part Description: SMT Chip Bead for Signal Line; Manufacturer: TDK; Power: 500mA; Resistance: 0.4R; Tolerance: ±25%; Part Number: IND0603_TDK_MMZ1608B601CTAH0; Component Kind: Standard; Component Type: Standard; Pin Count: 2; Value: 600R@100MHz; Status: None; Manufacturer Part Number: MMZ1608B601CTAH0; Case: 0603; Mounted: Yes; Socket: No; SMD: Yes; Sense: No; ComponentHeight: 0.75mm; HelpURL: \\cern.ch\dfs\Applications\Altium\Datasheets\IND0603_TDK_MMZ1608.pdf; Author: CERN DEM JMW; CreateDate: 21.04.2009; LatestRevisionDate: 25.10.2018
L7 L10 = 784383210047: WE-MAIA SMD Power Inductor, size 2506, 2.2 A, 0.47 uH; Rated Current: 2.2 A; Inductance: 0.47 uH; DC Resistance max.: 95 mOhm; ComponentLink1Description: Manufacturer; ComponentLink1URL: http://www.we-online.de; ComponentLink2Description: Datasheet; ComponentLink2URL: http://katalog.we-online.de/pbs/datasheet/784383210047.pdf; Part Number: 784383210047; Published Date: Nov. 2017; Publisher: Wurth Elektronik; Size: 2506; Operating Temperature: -40 to 125 degC
L8 = IND0603_TDK_MPZ1608R391A: Part Description: SMT Chip Bead for Power Line; Manufacturer: TDK; Power: 1.2A; Resistance: 0.12R; Tolerance: ±25%; Part Number: IND0603_TDK_MPZ1608R391A; Component Kind: Standard; Component Type: Standard; Pin Count: 2; Value: 390R@100MHz; Status: None; Manufacturer Part Number: MPZ1608R391A; Case: 0603; Mounted: Yes; Socket: No; SMD: Yes; Sense: No; ComponentHeight: 0.95mm; HelpURL: \\cern.ch\dfs\Applications\Altium\Datasheets\IND0603_TDK_MPZ1608.pdf; Author: CERN DEM JLC; CreateDate: 02.12.2009; LatestRevisionDate: 25.10.2018
L9 = 78438356022: WE-MAIA SMD Power Inductor, size 4020, 4.7 A, 2.2 uH; Rated Current: 4.7 A; Inductance: 2.2 uH; DC Resistance max.: 35 mOhm; ComponentLink1Description: Manufacturer; ComponentLink1URL: http://www.we-online.de; ComponentLink2Description: Datasheet; ComponentLink2URL: http://katalog.we-online.de/pbs/datasheet/78438356022.pdf; Part Number: 78438356022; Published Date: Nov. 2017; Publisher: Wurth Elektronik; Size: 4020; Operating Temperature: -40 to 125 degC
R21 R24 = R0603_10R_1%_0.1W_200PPM: Resistor - 1%; Part Description: General Purpose Thick Film Chip Resistor; Manufacturer: GENERIC; Manufacturer1 Part Number: NRC06F10R0TRF; Power: 0.1W; TC: ±200ppm/°C; PressFit: No; Part Number: R0603_10R_1%_0.1W_200PPM; Component Kind: Standard; Component Type: Standard; Pin Count: 2; Value: 10; Status: Preferred; Tolerance: ±1%; Manufacturer Part Number: R0603_10R_1%_0.1W_200PPM; Case: 0603; Mounted: Yes; Sense: No; Socket: No; SMD: Yes; Manufacturer1 Example: NIC COMPONENT; Manufacturer1 ComponentHeight: 0.55mm; HelpURL: \\cern.ch\dfs\Applications\Altium\Datasheets\R0603_NIC_NRC.pdf; Author: CERN DEM JLC; CreateDate: 03.12.2007; LatestRevisionDate: 24.06.2009
R22 R26 R29 R30 R33 R34 = R0402_10K_1%_0.0625W_100PPM: as R1 on sheet ipmi; Part Number: R0402_10K_1%_0.0625W_100PPM; Component Kind: Standard; Component Type: Standard; Pin Count: 2; Value: 10k; Status: Not Recommended; Power: 0.0625W; Tolerance: ±1%; Manufacturer Part Number: R0402_10K_1%_0.0625W_100PPM; Case: 0402; Mounted: Yes; Sense: No; Socket: No; SMD: Yes; Manufacturer1 Example: YAGEO PHYCOMP; Manufacturer1 ComponentHeight: 0.4mm; HelpURL: \\cern.ch\dfs\Applications\Altium\Datasheets\R0402_Phycomp_RC0402.pdf; Author: CERN DEM JLC; CreateDate: 03.12.2007; LatestRevisionDate: 17.10.2012
R23 = R0603_NO-VALUE: Resistor; Part Description: Reserved Footprint For a 0603 (1608) Chip Resistor; PressFit: No; Mounted: No; Part Number: R0603_NO-VALUE; Component Kind: Standard; Component Type: Standard; Pin Count: 2; Value: Undefined; Status: None; Manufacturer: Undefined; Manufacturer Part Number: R0603_NO-VALUE; Case: 0603; Sense: No; Socket: No; SMD: Yes; Manufacturer1 Example: Undefined; Manufacturer1 Part Number: Undefined; Manufacturer1 ComponentHeight: Undefined; HelpURL: Undefined; Author: CERN DEM JLC; CreateDate: 03.12.2007; LatestRevisionDate: 13.03.2008
R25 = R0402_20K_1%_0.0625W_100PPM: Resistor - 1%; Part Description: General Purpose Thick Film Chip Resistor; Manufacturer: GENERIC; Manufacturer1 Part Number: 232270672003L; TC: ±100ppm/°C; PressFit: No; Part Number: R0402_20K_1%_0.0625W_100PPM; Component Kind: Standard; Component Type: Standard; Pin Count: 2; Value: 20k; Status: Not Recommended; Power: 0.0625W; Tolerance: ±1%; Manufacturer Part Number: R0402_20K_1%_0.0625W_100PPM; Case: 0402; Mounted: Yes; Sense: No; Socket: No; SMD: Yes; Manufacturer1 Example: YAGEO PHYCOMP; Manufacturer1 ComponentHeight: 0.4mm; HelpURL: \\cern.ch\dfs\Applications\Altium\Datasheets\R0402_Phycomp_RC0402.pdf; Author: CERN DEM JLC; CreateDate: 03.12.2007; LatestRevisionDate: 17.10.2012
R27 R31 = R0603_0R_JUMPER: Resistor; Part Description: 1A (0.05R Max DC Resistance) Zero Ohm Jumper; Manufacturer: GENERIC; Manufacturer1 Part Number: NRC06Z0; PressFit: No; Part Number: R0603_0R_JUMPER; Component Kind: Standard; Component Type: Standard; Pin Count: 2; Value: 0; Status: Preferred; Manufacturer Part Number: R0603_0R_JUMPER; Case: 0603; Mounted: Yes; Sense: No; Socket: No; SMD: Yes; Manufacturer1 Example: NIC COMPONENT; Manufacturer1 ComponentHeight: 0.55mm; HelpURL: \\cern.ch\dfs\Applications\Altium\Datasheets\R0603_NIC_NRC.pdf; Author: CERN DEM JLC; CreateDate: 03.12.2007; LatestRevisionDate: 13.03.2008
R28 R32 = R0402_16K_1%_0.0625W_100PPM: Resistor - 1%; Part Description: General Purpose Thick Film Chip Resistor; Manufacturer: GENERIC; Manufacturer1 Part Number: 232270671603L; TC: ±100ppm/°C; PressFit: No; Part Number: R0402_16K_1%_0.0625W_100PPM; Component Kind: Standard; Component Type: Standard; Pin Count: 2; Value: 16k; Status: Not Recommended; Power: 0.0625W; Tolerance: ±1%; Manufacturer Part Number: R0402_16K_1%_0.0625W_100PPM; Case: 0402; Mounted: Yes; Sense: No; Socket: No; SMD: Yes; Manufacturer1 Example: YAGEO PHYCOMP; Manufacturer1 ComponentHeight: 0.4mm; HelpURL: \\cern.ch\dfs\Applications\Altium\Datasheets\R0402_Phycomp_RC0402.pdf; Author: CERN DEM JLC; CreateDate: 03.12.2007; LatestRevisionDate: 17.10.2012
U1 U2 = CMP-0786-00436-1: 1.2 A, Low VIN, Low Dropout Linear Regulator, 1.6 to 3.6 V Vin, 0.75 to 3 V Vout, Industrial, 16-pin QFN (CP-16-4), Reel; Manufacturer: Analog Devices; Vin (min) (V): 1.6; Vin (max) (V): 3.6; Vout Adjustable Range: 0.75V to 3.3V; Iout max: 1.2A; Supply Current IGND @ Small Load: 90uA; PackageVersion: 010606-0, 01/2006; ComponentLink3URL: http://www.analog.com/static/imported-files/packages/46009454504174339653421710019CP_16_4.pdf; ComponentLink4URL: Product URL:http://www.analog.com/en/ADP1755/productSearch.html; ComponentLink1Description: Manufacturer URL; Packing: Reel; PackageDescription: 16-Pin Lead Frame Chip Scale Package, Body 4 x 4 mm, Pitch 0.65 mm; ComponentLink2URL: http://www.analog.com/static/imported-files/data_sheets/ADP1754_1755.pdf; PackageReference: CP-16-4; DatasheetVersion: Rev. D; ComponentLink4Description: URL Link1; Code_JEDEC: MO-220-VGGC; PartNumber: ADP1755ACPZ-R7; ComponentLink3Description: Package Specification; Mounting Technology: Surface Mount; ComponentLink1URL: http://www.analog.com/en/index.html; ComponentLink2Description: Datasheet